# EAGLE design Template_V1.0 (EAGLE 7.2.0)
CNAME: EARS PocketQube Template; CREVISION: 0.1; DESIGNER: M. Isbell & L. Stant
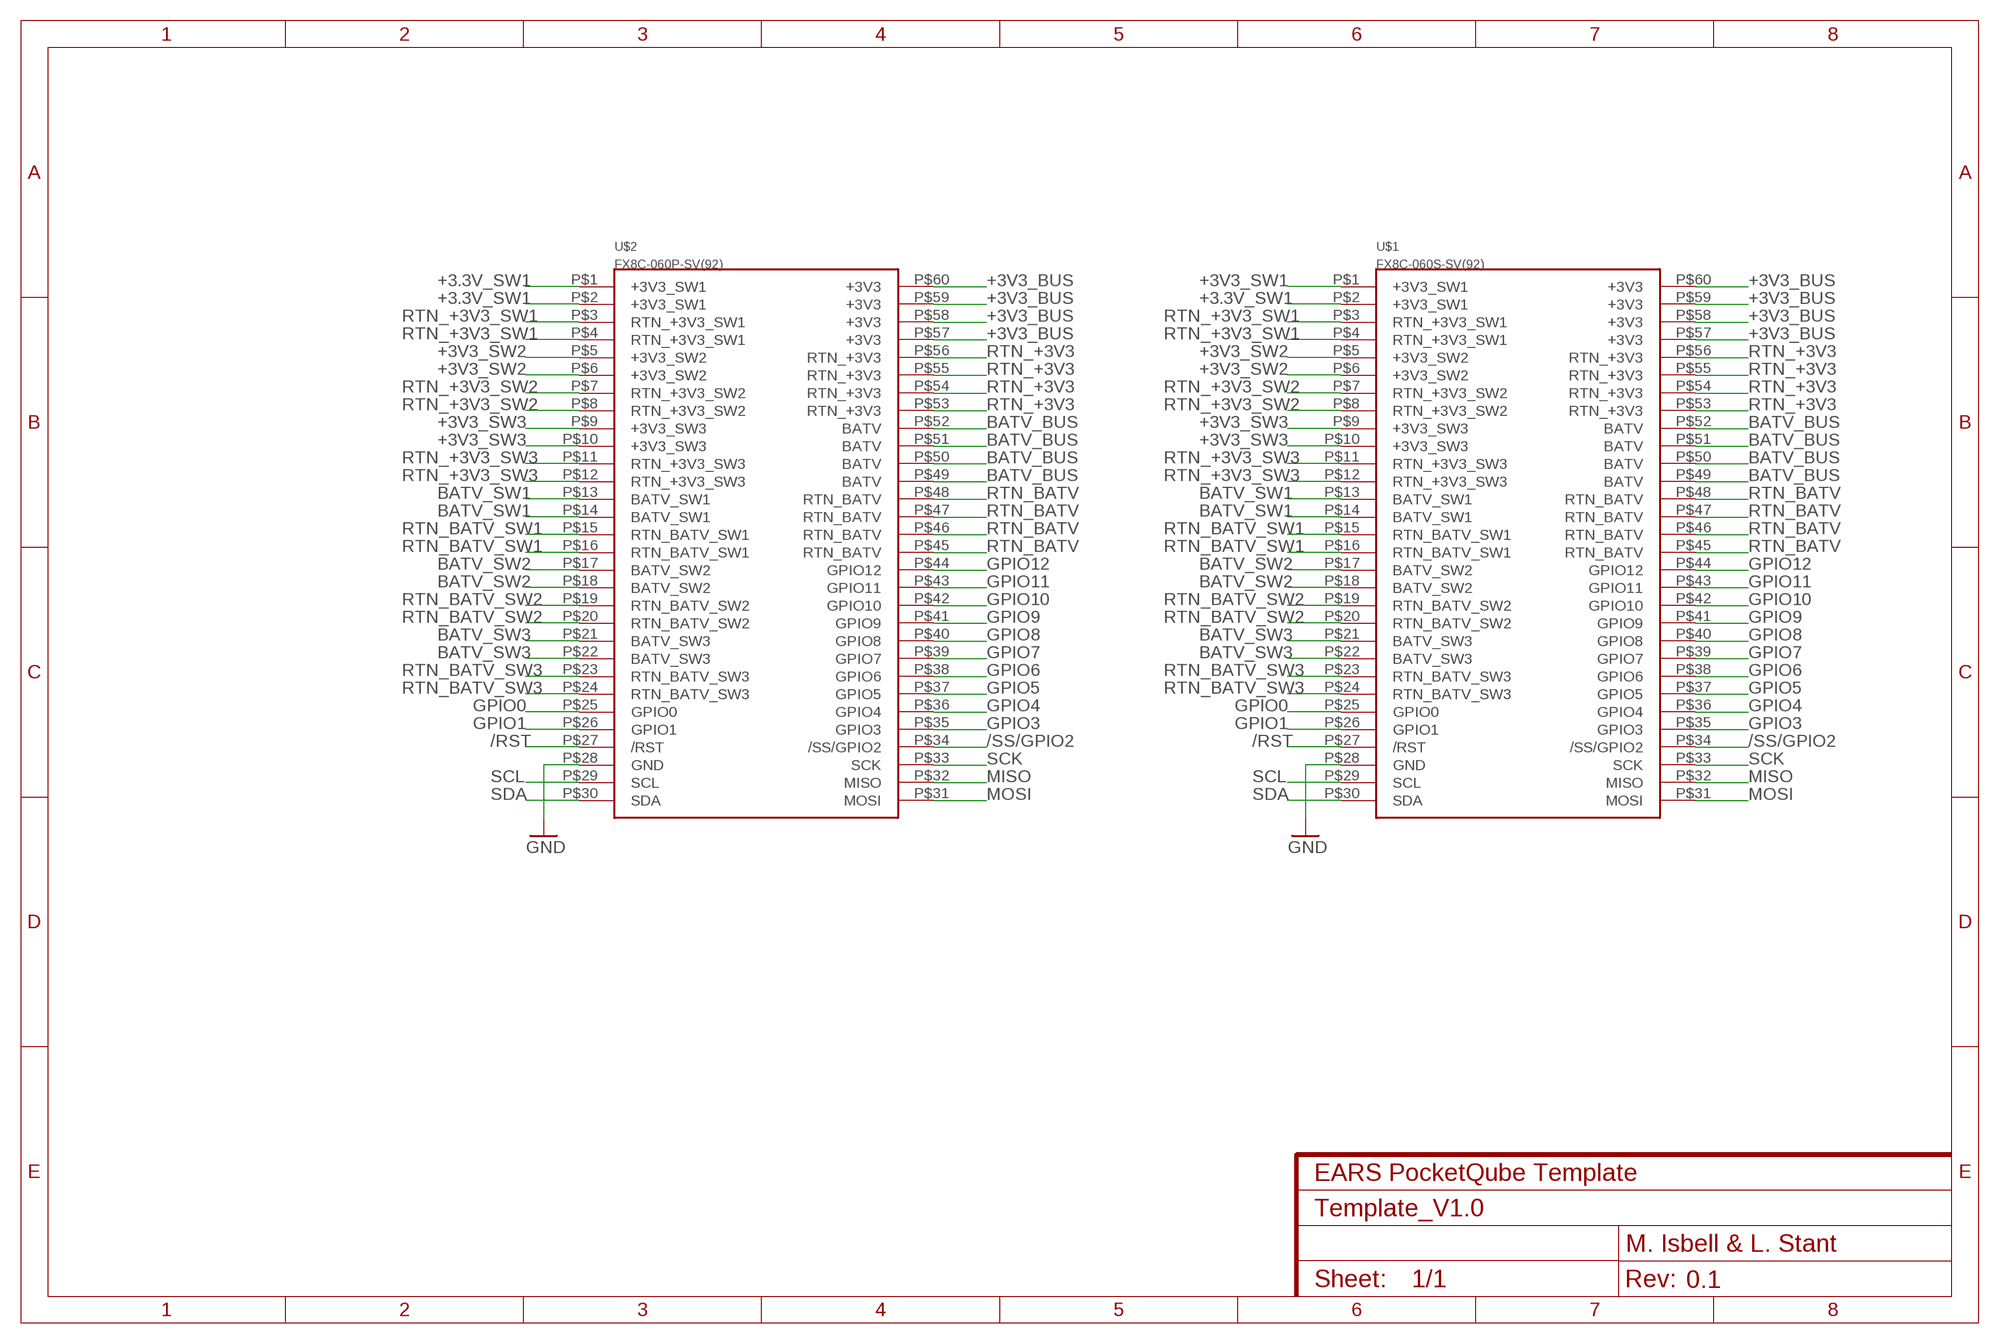
[diagram p0: schematic, sheet 1]

## Parts
U$1  FX8C-060S-SV(92)  [FX8C-060S-SV(92)]
U$2  FX8C-060P-SV(92)  [FX8C-060P-SV(92)]

## Nets
+3.3V_SW1: U$1.P$2(+3V3_SW1) U$2.P$1(+3V3_SW1) U$2.P$2(+3V3_SW1)
+3V3_BUS: U$1.P$57(+3V3) U$1.P$58(+3V3) U$1.P$59(+3V3) U$1.P$60(+3V3) U$2.P$57(+3V3) U$2.P$58(+3V3) U$2.P$59(+3V3) U$2.P$60(+3V3)
+3V3_SW1: U$1.P$1(+3V3_SW1)
+3V3_SW2: U$1.P$5(+3V3_SW2) U$1.P$6(+3V3_SW2) U$2.P$5(+3V3_SW2) U$2.P$6(+3V3_SW2)
+3V3_SW3: U$1.P$9(+3V3_SW3) U$1.P$10(+3V3_SW3) U$2.P$9(+3V3_SW3) U$2.P$10(+3V3_SW3)
/RST: U$1.P$27(/RST) U$2.P$27(/RST)
/SS/GPIO2: U$1.P$34(/SS/GPIO2) U$2.P$34(/SS/GPIO2)
BATV_BUS: U$1.P$49(BATV) U$1.P$50(BATV) U$1.P$51(BATV) U$1.P$52(BATV) U$2.P$49(BATV) U$2.P$50(BATV) U$2.P$51(BATV) U$2.P$52(BATV)
BATV_SW1: U$1.P$13(BATV_SW1) U$1.P$14(BATV_SW1) U$2.P$13(BATV_SW1) U$2.P$14(BATV_SW1)
BATV_SW2: U$1.P$17(BATV_SW2) U$1.P$18(BATV_SW2) U$2.P$17(BATV_SW2) U$2.P$18(BATV_SW2)
BATV_SW3: U$1.P$21(BATV_SW3) U$1.P$22(BATV_SW3) U$2.P$21(BATV_SW3) U$2.P$22(BATV_SW3)
GND: U$1.P$28(GND) U$2.P$28(GND)
GPIO0: U$1.P$25(GPIO0) U$2.P$25(GPIO0)
GPIO1: U$1.P$26(GPIO1) U$2.P$26(GPIO1)
GPIO3: U$1.P$35(GPIO3) U$2.P$35(GPIO3)
GPIO4: U$1.P$36(GPIO4) U$2.P$36(GPIO4)
GPIO5: U$1.P$37(GPIO5) U$2.P$37(GPIO5)
GPIO6: U$1.P$38(GPIO6) U$2.P$38(GPIO6)
GPIO7: U$1.P$39(GPIO7) U$2.P$39(GPIO7)
GPIO8: U$1.P$40(GPIO8) U$2.P$40(GPIO8)
GPIO9: U$1.P$41(GPIO9) U$2.P$41(GPIO9)
GPIO10: U$1.P$42(GPIO10) U$2.P$42(GPIO10)
GPIO11: U$1.P$43(GPIO11) U$2.P$43(GPIO11)
GPIO12: U$1.P$44(GPIO12) U$2.P$44(GPIO12)
MISO: U$1.P$32(MISO) U$2.P$32(MISO)
MOSI: U$1.P$31(MOSI) U$2.P$31(MOSI)
RTN_+3V3: U$1.P$53(RTN_+3V3) U$1.P$54(RTN_+3V3) U$1.P$55(RTN_+3V3) U$1.P$56(RTN_+3V3) U$2.P$53(RTN_+3V3) U$2.P$54(RTN_+3V3) U$2.P$55(RTN_+3V3) U$2.P$56(RTN_+3V3)
RTN_+3V3_SW1: U$1.P$3(RTN_+3V3_SW1) U$1.P$4(RTN_+3V3_SW1) U$2.P$3(RTN_+3V3_SW1) U$2.P$4(RTN_+3V3_SW1)
RTN_+3V3_SW2: U$1.P$7(RTN_+3V3_SW2) U$1.P$8(RTN_+3V3_SW2) U$2.P$7(RTN_+3V3_SW2) U$2.P$8(RTN_+3V3_SW2)
RTN_+3V3_SW3: U$1.P$11(RTN_+3V3_SW3) U$1.P$12(RTN_+3V3_SW3) U$2.P$11(RTN_+3V3_SW3) U$2.P$12(RTN_+3V3_SW3)
RTN_BATV: U$1.P$45(RTN_BATV) U$1.P$46(RTN_BATV) U$1.P$47(RTN_BATV) U$1.P$48(RTN_BATV) U$2.P$45(RTN_BATV) U$2.P$46(RTN_BATV) U$2.P$47(RTN_BATV) U$2.P$48(RTN_BATV)
RTN_BATV_SW1: U$1.P$15(RTN_BATV_SW1) U$1.P$16(RTN_BATV_SW1) U$2.P$15(RTN_BATV_SW1) U$2.P$16(RTN_BATV_SW1)
RTN_BATV_SW2: U$1.P$19(RTN_BATV_SW2) U$1.P$20(RTN_BATV_SW2) U$2.P$19(RTN_BATV_SW2) U$2.P$20(RTN_BATV_SW2)
RTN_BATV_SW3: U$1.P$23(RTN_BATV_SW3) U$1.P$24(RTN_BATV_SW3) U$2.P$23(RTN_BATV_SW3) U$2.P$24(RTN_BATV_SW3)
SCK: U$1.P$33(SCK) U$2.P$33(SCK)
SCL: U$1.P$29(SCL) U$2.P$29(SCL)
SDA: U$1.P$30(SDA) U$2.P$30(SDA)

## Library data of the parts
U$1 = Template:FX8C-060S-SV(92)
U$2 = Template:FX8C-060P-SV(92)

## Board
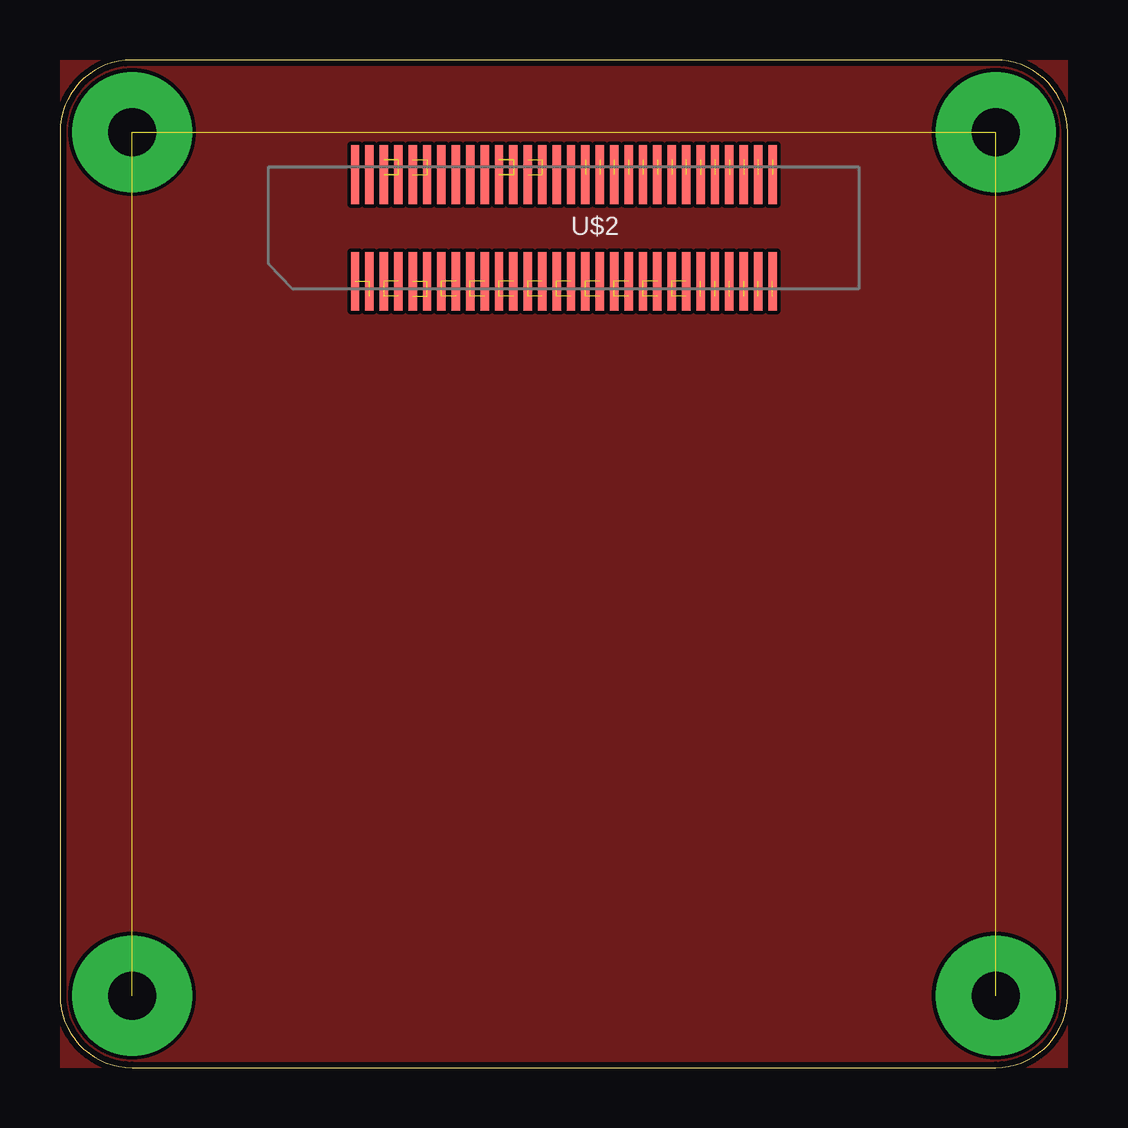
[diagram p1: board, top side]
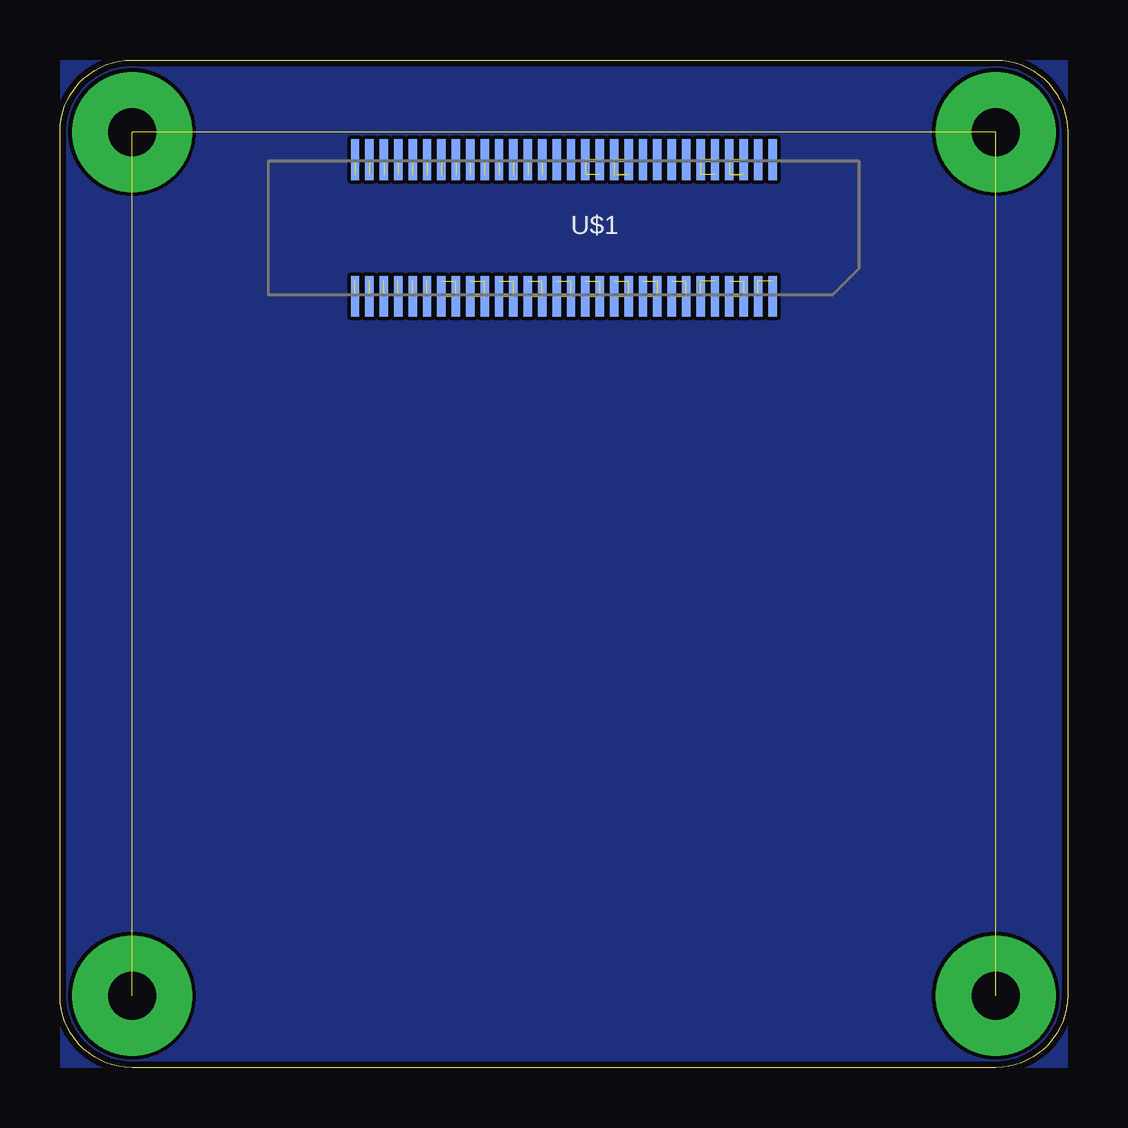
[diagram p2: board, bottom side, seen from below]

Size 42 x 42 mm. Coordinates in mm from the lower left corner, seen from the top.
Outline: 3,0 39,0 arc90 42,3 42,39 arc90 39,42 3,42 arc90 0,39 0,3 arc90 3,0
Copper layers (1*16): Top 0.035mm / dielectric 1.5mm / Bottom 0.035mm
Design rules "SeeedStudio_2layer_DRU_no_angle_20140221": minimum track width 6mil, minimum drill 12mil, track to track 6mil, track to pad 6mil, pad to pad 6mil, via to via 6mil, smd to smd 0mil, copper to edge 10mil, drill to drill 10mil, minimum pad ring 10mil, minimum via ring 6mil, stop-mask expansion 2mil, vias tented up to drill 100mil, thermal gap 10mil

### Footprints (pad centres in the part's own frame; a part is rotated, then mirrored left to right if it is on the bottom)
FX8C-060S-SV(92) = smd 0.35 x 1.7: P$1 -8.7,2.85; P$2 -8.1,2.85; P$3 -7.5,2.85; P$4 -6.9,2.85; P$5 -6.3,2.85; P$6 -5.7,2.85; P$7 -5.1,2.85; P$8 -4.5,2.85; P$9 -3.9,2.85; P$10 -3.3,2.85; P$11 -2.7,2.85; P$12 -2.1,2.85; P$13 -1.5,2.85; P$14 -0.9,2.85; P$15 -0.3,2.85; P$16 0.3,2.85; P$17 0.9,2.85; P$18 1.5,2.85; P$19 2.1,2.85; P$20 2.7,2.85; P$21 3.3,2.85; P$22 3.9,2.85; P$23 4.5,2.85; P$24 5.1,2.85; P$25 5.7,2.85; P$26 6.3,2.85; P$27 6.9,2.85; P$28 7.5,2.85; P$29 8.1,2.85; P$30 8.7,2.85; P$31 8.7,-2.85; P$32 8.1,-2.85; P$33 7.5,-2.85; P$34 6.9,-2.85; P$35 6.3,-2.85; P$36 5.7,-2.85; P$37 5.1,-2.85; P$38 4.5,-2.85; P$39 3.9,-2.85; P$40 3.3,-2.85; P$41 2.7,-2.85; P$42 2.1,-2.85; P$43 1.5,-2.85; P$44 0.9,-2.85; P$45 0.3,-2.85; P$46 -0.3,-2.85; P$47 -0.9,-2.85; P$48 -1.5,-2.85; P$49 -2.1,-2.85; P$50 -2.7,-2.85; P$51 -3.3,-2.85; P$52 -3.9,-2.85; P$53 -4.5,-2.85; P$54 -5.1,-2.85; P$55 -5.7,-2.85; P$56 -6.3,-2.85; P$57 -6.9,-2.85; P$58 -7.5,-2.85; P$59 -8.1,-2.85; P$60 -8.7,-2.85
FX8C-060P-SV(92) = smd 0.35 x 2.45: P$1 -8.7,-2.225; P$2 -8.1,-2.225; P$3 -7.5,-2.225; P$4 -6.9,-2.225; P$5 -6.3,-2.225; P$6 -5.7,-2.225; P$7 -5.1,-2.225; P$8 -4.5,-2.225; P$9 -3.9,-2.225; P$10 -3.3,-2.225; P$11 -2.7,-2.225; P$12 -2.1,-2.225; P$13 -1.5,-2.225; P$14 -0.9,-2.225; P$15 -0.3,-2.225; P$16 0.3,-2.225; P$17 0.9,-2.225; P$18 1.5,-2.225; P$19 2.1,-2.225; P$20 2.7,-2.225; P$21 3.3,-2.225; P$22 3.9,-2.225; P$23 4.5,-2.225; P$24 5.1,-2.225; P$25 5.7,-2.225; P$26 6.3,-2.225; P$27 6.9,-2.225; P$28 7.5,-2.225; P$29 8.1,-2.225; P$30 8.7,-2.225; P$31 8.7,2.225; P$32 8.1,2.225; P$33 7.5,2.225; P$34 6.9,2.225; P$35 6.3,2.225; P$36 5.7,2.225; P$37 5.1,2.225; P$38 4.5,2.225; P$39 3.9,2.225; P$40 3.3,2.225; P$41 2.7,2.225; P$42 2.1,2.225; P$43 1.5,2.225; P$44 0.9,2.225; P$45 0.3,2.225; P$46 -0.3,2.225; P$47 -0.9,2.225; P$48 -1.5,2.225; P$49 -2.1,2.225; P$50 -2.7,2.225; P$51 -3.3,2.225; P$52 -3.9,2.225; P$53 -4.5,2.225; P$54 -5.1,2.225; P$55 -5.7,2.225; P$56 -6.3,2.225; P$57 -6.9,2.225; P$58 -7.5,2.225; P$59 -8.1,2.225; P$60 -8.7,2.225

### Placement (x,y rotation side)
U$1  21,35 180 bottom
U$2  21,35 0 top

### Tracks (layer width: path | path; a pad name or v marks a point on that pad's centre or on a via)
+3.3V_SW1  (2 unrouted)
+3V3_BUS  (7 unrouted)
+3V3_SW2  (3 unrouted)
+3V3_SW3  (3 unrouted)
/RST  (1 unrouted)
/SS/GPIO2  (1 unrouted)
BATV_BUS  (7 unrouted)
BATV_SW1  (3 unrouted)
BATV_SW2  (3 unrouted)
BATV_SW3  (3 unrouted)
BOARD
  pour Bottom: 0,42 42,42 42,0 0,0
  pour Top: 0,42 42,42 42,0 0,0
CHASSIS_GND  (via drill 2 pad 5)  (3 unrouted)
  other vias: 3,39 39,39 39,3 3,3
GND  (1 unrouted)
GPIO0  (1 unrouted)
GPIO1  (1 unrouted)
GPIO3  (1 unrouted)
GPIO4  (1 unrouted)
GPIO5  (1 unrouted)
GPIO6  (1 unrouted)
GPIO7  (1 unrouted)
GPIO8  (1 unrouted)
GPIO9  (1 unrouted)
GPIO10  (1 unrouted)
GPIO11  (1 unrouted)
GPIO12  (1 unrouted)
MISO  (1 unrouted)
MOSI  (1 unrouted)
RTN_+3V3  (7 unrouted)
RTN_+3V3_SW1  (3 unrouted)
RTN_+3V3_SW2  (3 unrouted)
RTN_+3V3_SW3  (3 unrouted)
RTN_BATV  (7 unrouted)
RTN_BATV_SW1  (3 unrouted)
RTN_BATV_SW2  (3 unrouted)
RTN_BATV_SW3  (3 unrouted)
SCK  (1 unrouted)
SCL  (1 unrouted)
SDA  (1 unrouted)

### Text on the board
tDocu: SurreyEARS Pocketqube | Template Board | V1.0